# Altium schematic sheet power_supply.SchDoc
size A; SheetNumber: 2; SheetTotal: 5
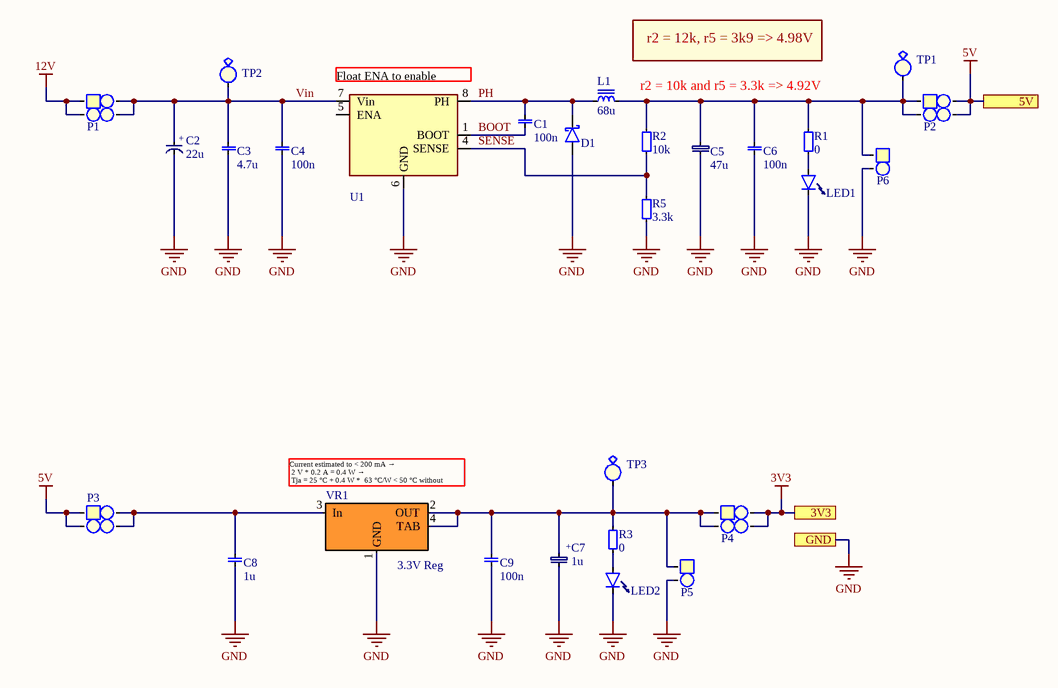
[diagram p0: power_supply.SchDoc]

## Parts
C1  value 100n  [1210, cap]  (hidden comment: 1210, capacitor)
C2  value 22u  [EEEFT1E220AR]  (hidden comment: cap, Electrolyt Case B)
C3  value 4.7u  [1812, cap]  (hidden comment: 1812, capacitor)
C4  value 100n  [1210, cap]  (hidden comment: 1210, capacitor)
C5  value 47u  [CASE_E]  (hidden comment: cap, Case E)
C6  value 100n  [1210, cap]  (hidden comment: 1210, capacitor)
C7  value 1u  [CASE_B]  (hidden comment: Cap, case B)
C8  value 1u  [0603 cap]  (hidden comment: 0603, capacitor)
C9  value 100n  [0603 cap]  (hidden comment: 0603, capacitor)
D1  B340A-E3/61T  [DO-214AC]  (value not drawn)
L1  value 68u  [MSS1260]  (hidden comment: Coil, MSS1260)
LED1  0603, LED  [0603 LED]  (value not drawn)
LED2  0603, LED  [0603 LED]  (value not drawn)
P1  2x2 Pin Header  [2x2 PH]  (value not drawn)
P2  2x2 Pin Header  [2x2 PH]  (value not drawn)
P3  2x2 Pin Header  [2x2 PH]  (value not drawn)
P4  2x2 Pin Header  [2x2 PH]  (value not drawn)
P5  1x2 Pin Header  [padtwo_L]  (value not drawn)
P6  1x2 Pin Header  [padtwo_L]  (value not drawn)
R1  value 0  [0603]  (hidden comment: 0603, resistor)
R2  value 10k  [0603]  (hidden comment: 0603, resistor)
R3  value 0  [0603]  (hidden comment: 0603, resistor)
R5  value 3.3k  [0603]  (hidden comment: 0603, resistor)
TP1  Test Point  [testPoint]  (value not drawn)
TP2  Test Point  [testPoint]  (value not drawn)
TP3  Test Point  [testPoint]  (value not drawn)
U1  TPS5410  [SOIC8]  (value not drawn)
VR1  3.3V Reg  [SOT223]

## Ports
3V3, 5V, GND

## Nets
3V3: P4.3 P4.4 ; port 3V3
5V: P2.3 P2.4 P3.1 P3.2 ; port 5V
12V: P1.1 P1.2
GND: C2.1 C3.0 C4.0 C5.2 C6.0 C7.1 C8.0 C9.0 D1.3(A) LED1.0(Cathode) LED2.0(Cathode) P5.2 P6.2 R5.1 U1.6(GND) VR1.1(GND) ; port GND
BOOT: C1.0 U1.1(BOOT)
PH: C1.1 D1.1(K) L1.2 U1.8(PH)
SENSE: R2.1 R5.0 U1.4(SENSE)
Vin: C2.2 C3.1 C4.1 P1.3 P1.4 TP2.0 U1.7(Vin)
NetC5_1: C5.1 C6.1 L1.1 P2.1 P2.2 P6.1 R1.0 R2.0 TP1.0
NetC7_2: C7.2 C9.1 P4.1 P4.2 P5.1 R3.0 TP3.0 VR1.2(OUT) VR1.4(TAB)
NetC8_1: C8.1 P3.3 P3.4 VR1.3(In)
NetLED1_1: LED1.1 R1.1
NetLED2_1: LED2.1 R3.1

Not connected (* = marked no-connect by the designer): U1 5(ENA)

## Notes on the sheet
- (near U1) Float ENA to enable
- r2 = 10k and r5 = 3.3k => 4.92V
- r2 = 12k, r5 = 3k9 => 4.98V
- (near VR1) Current estimated to < 200 mA →
  2 V * 0.2 A = 0.4 W →
  Tja = 25 °C + 0.4 W *  63 °C/W < 50 °C without heatsink
- (in symbol Cap, case B) +
- (in symbol cap, Electrolyt Case B) +

## Library data of the parts
C1 C4 C6 = 1210, capacitor: Order number: 478-1556-1-ND; Supplier: Digikey
C3 = 1812, capacitor: Part Number: C1812C475K5RACTU; Order Number: 399-8255-1-ND
C5 = cap, Case E: Tantalum; Part Number: TPSE476K020R0200; Order Number: *
D1 = B340A-E3/61T: SchottkydiodE, 40 V, 3 A; Value: Schottky Diode; Farnell: 2335183
L1 = Coil, MSS1260: 68 µH, 2.3 A,; Part Number: SRR1260-680M; Order Number: *
P1-P4 = 2x2 Pin Header: Value: 2x2 Pin Header, 2.54mm
P5 P6 = 1x2 Pin Header: 2.54 mm, TH; Value: 1x2 Pin Header
U1 = TPS5410: 1-A, Wide Input Range, Step-Down Converter; Value: *; Supplier: *; Order Number: *
VR1 = TLV1117LV: TLV1117LV 1-A, Positive Fixed-Voltage, Low-Dropout Regulator; Value: TLV1117LV
LED1 LED2 = 0603, LED
  LED1: Order Number: *
TP1-TP3 = Test Point: Value: Test point; Farnell: 1702006